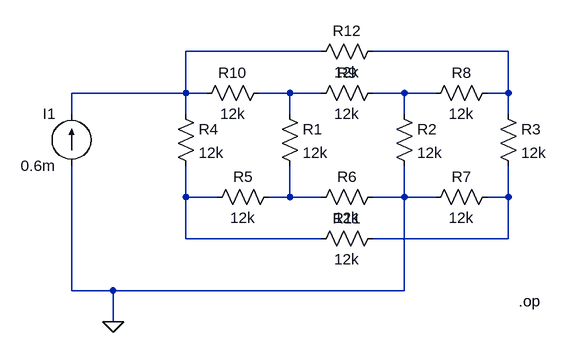
[diagram p0: schematic Part 1- DC analysis a.asc]
Part 1- DC analysis a.asc, the LTspice schematic file:
Version 4
SHEET 1 880 680
WIRE 368 -48 160 -48
WIRE 656 -48 448 -48
WIRE 160 16 160 -48
WIRE 160 16 -16 16
WIRE 192 16 160 16
WIRE 320 16 272 16
WIRE 368 16 320 16
WIRE 496 16 448 16
WIRE 544 16 496 16
WIRE 656 16 656 -48
WIRE 656 16 624 16
WIRE -16 48 -16 16
WIRE 160 48 160 16
WIRE 320 48 320 16
WIRE 496 48 496 16
WIRE 656 48 656 16
WIRE 160 176 160 128
WIRE 208 176 160 176
WIRE 320 176 320 128
WIRE 320 176 288 176
WIRE 368 176 320 176
WIRE 496 176 496 128
WIRE 496 176 448 176
WIRE 544 176 496 176
WIRE 656 176 656 128
WIRE 656 176 624 176
WIRE 160 240 160 176
WIRE 368 240 160 240
WIRE 656 240 656 176
WIRE 656 240 448 240
WIRE -16 320 -16 128
WIRE 48 320 -16 320
WIRE 496 320 496 176
WIRE 496 320 48 320
WIRE 48 368 48 320
FLAG 48 368 0
SYMBOL res 304 32 R0
SYMATTR InstName R1
SYMATTR Value 12k
SYMBOL res 480 32 R0
SYMATTR InstName R2
SYMATTR Value 12k
SYMBOL res 640 32 R0
SYMATTR InstName R3
SYMATTR Value 12k
SYMBOL res 144 32 R0
SYMATTR InstName R4
SYMATTR Value 12k
SYMBOL res 304 160 R90
WINDOW 0 0 56 VBottom 2
WINDOW 3 32 56 VTop 2
SYMATTR InstName R5
SYMATTR Value 12k
SYMBOL res 464 160 R90
WINDOW 0 0 56 VBottom 2
WINDOW 3 32 56 VTop 2
SYMATTR InstName R6
SYMATTR Value 12k
SYMBOL res 640 160 R90
WINDOW 0 0 56 VBottom 2
WINDOW 3 32 56 VTop 2
SYMATTR InstName R7
SYMATTR Value 12k
SYMBOL res 640 0 R90
WINDOW 0 0 56 VBottom 2
WINDOW 3 32 56 VTop 2
SYMATTR InstName R8
SYMATTR Value 12k
SYMBOL res 464 0 R90
WINDOW 0 0 56 VBottom 2
WINDOW 3 32 56 VTop 2
SYMATTR InstName R9
SYMATTR Value 12k
SYMBOL res 288 0 R90
WINDOW 0 0 56 VBottom 2
WINDOW 3 32 56 VTop 2
SYMATTR InstName R10
SYMATTR Value 12k
SYMBOL res 464 224 R90
WINDOW 0 0 56 VBottom 2
WINDOW 3 32 56 VTop 2
SYMATTR InstName R11
SYMATTR Value 12k
SYMBOL res 464 -64 R90
WINDOW 0 0 56 VBottom 2
WINDOW 3 32 56 VTop 2
SYMATTR InstName R12
SYMATTR Value 12k
SYMBOL current -16 128 R180
WINDOW 0 24 80 Left 2
WINDOW 3 24 0 Left 2
SYMATTR InstName I1
SYMATTR Value 0.6m
TEXT 672 336 Left 2 !.op

The netlist it stands for:
* Part 1- DC analysis a.asc
R1 N003 N006 12k
R2 N004 0 12k
R3 N002 N007 12k
R4 N001 N005 12k
R5 N006 N005 12k
R6 0 N006 12k
R7 N007 0 12k
R8 N002 N004 12k
R9 N004 N003 12k
R10 N003 N001 12k
R11 N007 N005 12k
R12 N002 N001 12k
I1 0 N001 0.6m
.op
.backanno
.end